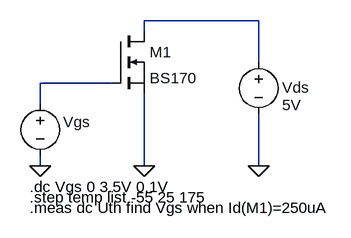
[diagram p0: schematic MOSFET_Trans.asc]
MOSFET_Trans.asc, the LTspice schematic file:
Version 4.1
SHEET 1 1292 680
WIRE -544 -224 -720 -224
WIRE -720 -208 -720 -224
WIRE -544 -160 -544 -224
WIRE -768 -128 -880 -128
WIRE -880 -96 -880 -128
WIRE -880 0 -880 -16
WIRE -720 0 -720 -112
WIRE -544 0 -544 -80
FLAG -544 0 0
FLAG -880 0 0
FLAG -720 0 0
SYMBOL voltage -544 -176 R0
WINDOW 123 0 0 Left 2
WINDOW 0 36 55 Left 2
WINDOW 3 36 82 Left 2
WINDOW 39 0 0 Left 0
SYMATTR InstName Vds
SYMATTR Value 5V
SYMBOL voltage -880 -112 R0
WINDOW 123 0 0 Left 2
WINDOW 39 40 53 Left 2
WINDOW 3 -97 181 Left 2
WINDOW 0 35 44 Left 2
SYMATTR Value ""
SYMATTR InstName Vgs
SYMBOL nmos -768 -208 R0
SYMATTR InstName M1
SYMATTR Value BS170
TEXT -896 32 Left 2 !.dc Vgs 0 3.5V 0.1V
TEXT -896 48 Left 2 !.step temp list -55 25 175
TEXT -896 64 Left 2 !.meas dc Uth find Vgs when Id(M1)=250uA

The netlist it stands for:
* MOSFET_Trans.asc
Vds N001 0 5V
Vgs N002 0
M1 N001 N002 0 0 BS170
.model NMOS NMOS
.model PMOS PMOS
.lib standard.mos
.dc Vgs 0 3.5V 0.1V
.step temp list -55 25 175
.meas dc Uth find Vgs when Id(M1)=250uA
.backanno
.end